# Altium schematic sheet boost-converter.SchDoc
size A4; DrawnBy: Lorna Lan, Jaden Reimer; DocumentNumber: 3; Revision: v4.3; SheetNumber: 3; SheetTotal: 20
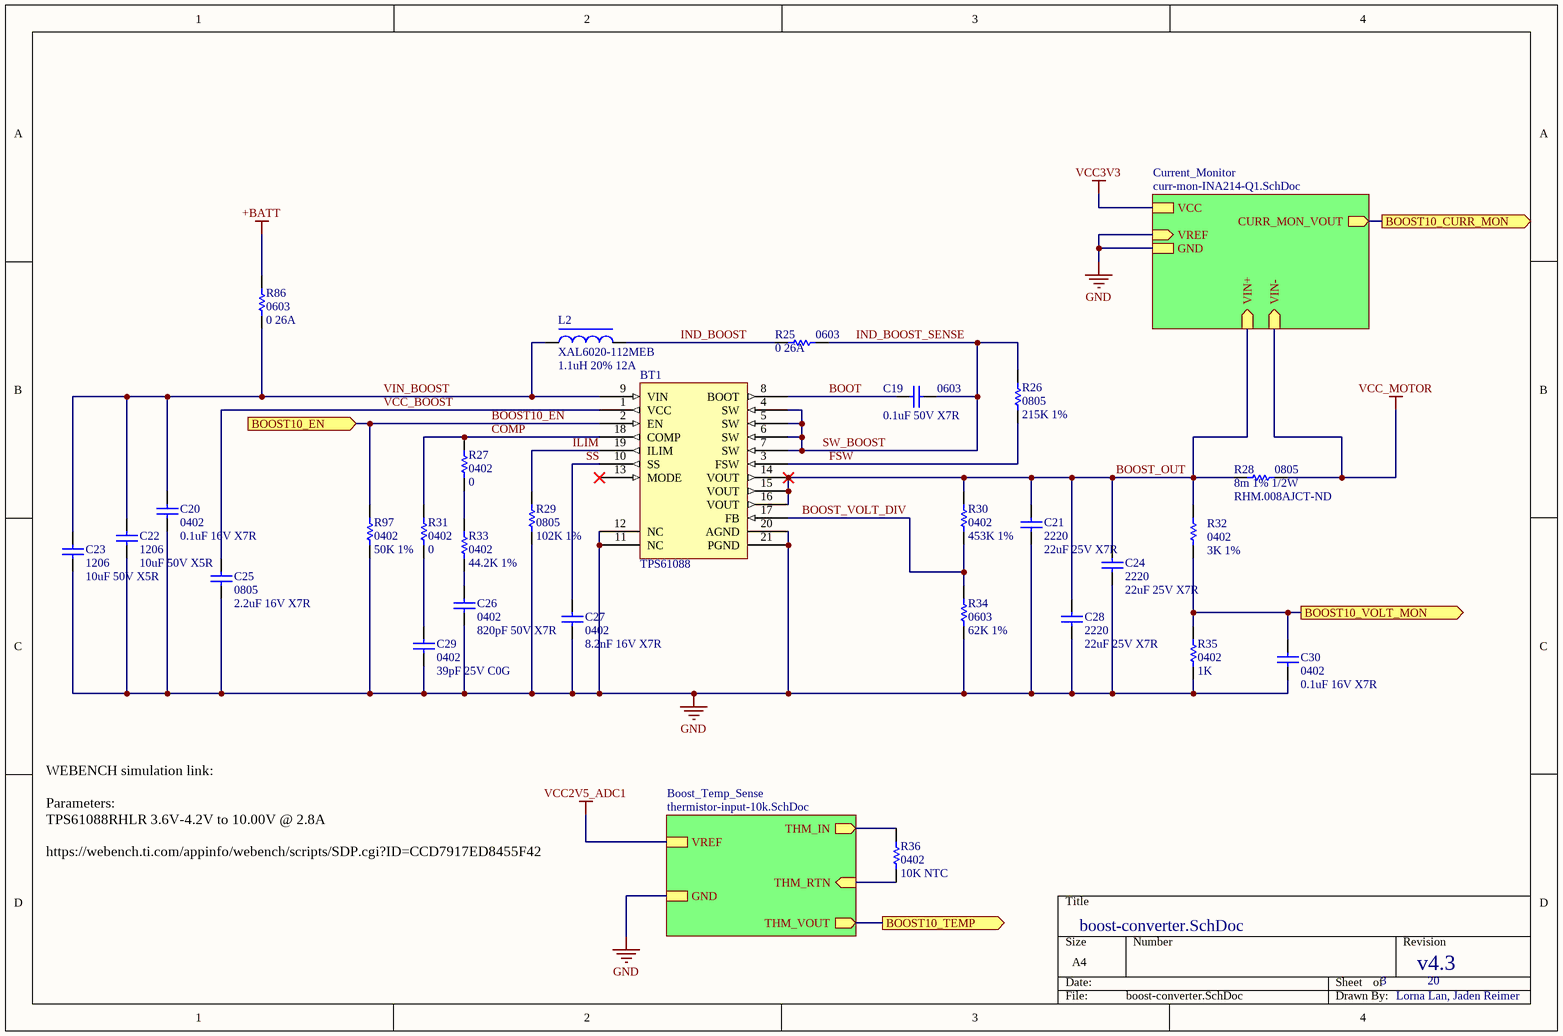
[diagram p0: boost-converter.SchDoc]

## Parts
BT1  TPS61088  [QFN50P450X350X100-21N]
C19  0603  value 0.1uF 50V X7R  [CAP0603R]
C20  0402  value 0.1uF 16V X7R  [CAP0402R]
C21  2220  value 22uF 25V X7R  [CAP2220]
C22  1206  value 10uF 50V X5R  [CAP1206R]
C23  1206  value 10uF 50V X5R  [CAP1206R]
C24  2220  value 22uF 25V X7R  [CAP2220]
C25  0805  value 2.2uF 16V X7R  [CAP0805R]
C26  0402  value 820pF 50V X7R  [CAP0402R]
C27  0402  value 8.2nF 16V X7R  [CAP0402R]
C28  2220  value 22uF 25V X7R  [CAP2220]
C29  0402  value 39pF 25V C0G  [CAP0402R]
C30  0402  value 0.1uF 16V X7R  [CAP0402R]
L2  XAL6020-112MEB  value 1.1uH 20% 12A  [XAL6020-112MEB]
R25  0603  value 0 26A  [RES0603R]
R26  0805  value 215K 1%  [RES0805R]
R27  0402  value 0  [RES0402R]
R28  0805  value 8m 1% 1/2W  Supplier Part Number 1: RHM.008AJCT-ND  [RES0805R]
R29  0805  value 102K 1%  [RES0805R]
R30  0402  value 453K 1%  [RES0402R]
R31  0402  value 0  [RES0402R]
R32  0402  value 3K 1%  [RES0402R]
R33  0402  value 44.2K 1%  [RES0402R]
R34  0603  value 62K 1%  [RES0603R]
R35  0402  value 1K  [RES0402R]
R36  0402  value 10K NTC  [RES0402R]
R86  0603  value 0 26A  [RES0603R]
R97  0402  value 50K 1%  [RES0402R]

## Sub-sheets
Boost_Temp_Sense = thermistor-input-10k.SchDoc: GND, THM_VOUT (out), VREF, THM_IN (out), THM_RTN (in)
Current_Monitor = curr-mon-INA214-Q1.SchDoc: VCC, VREF (in), VIN+ (in), GND, VIN- (in), CURR_MON_VOUT (out)

## Ports
BOOST10_CURR_MON (out), BOOST10_EN (in), BOOST10_TEMP (out), BOOST10_VOLT_MON (out)

## Nets
+BATT: R86.2
GND: BT1.11(NC) BT1.12(NC) BT1.20(AGND) BT1.21(PGND) C20.1 C21.1 C22.1 C23.1 C24.1 C25.1 C26.1 C27.1 C28.1 C29.1 C30.1 R29.1 R34.1 R35.1 R97.1 ; sheet Current_Monitor/VREF, sheet Current_Monitor/GND, sheet Boost_Temp_Sense/GND
VCC2V5_ADC1: sheet Boost_Temp_Sense/VREF
VCC3V3: sheet Current_Monitor/VCC
VCC_MOTOR: R28.2 ; sheet Current_Monitor/VIN-
BOOST10_CURR_MON: port BOOST10_CURR_MON, sheet Current_Monitor/CURR_MON_VOUT
BOOST10_EN: BT1.2(EN) R97.2 ; port BOOST10_EN
BOOST10_TEMP: port BOOST10_TEMP, sheet Boost_Temp_Sense/THM_VOUT
BOOST10_VOLT_MON: C30.2 R32.1 R35.2 ; port BOOST10_VOLT_MON
BOOST_OUT: BT1.14(VOUT) BT1.15(VOUT) BT1.16(VOUT) C21.2 C24.2 C28.2 R28.1 R30.2 R32.2 ; sheet Current_Monitor/VIN+
BOOST_VOLT_DIV: BT1.17(FB) R30.1 R34.2
BOOT: BT1.8(BOOT) C19.1
COMP: BT1.18(COMP) R27.2 R31.2
FSW: BT1.3(FSW) R26.1
ILIM: BT1.19(ILIM) R29.2
IND_BOOST: L2.2 R25.1
IND_BOOST_SENSE: BT1.4(SW) BT1.5(SW) BT1.6(SW) BT1.7(SW) C19.2 R25.2 R26.2  [also labelled SW_BOOST]
SS: BT1.10(SS) C27.2
VCC_BOOST: BT1.1(VCC) C25.2
VIN_BOOST: BT1.9(VIN) C20.2 C22.2 C23.2 L2.1 R86.1
NetC26_2: C26.2 R33.1
NetC29_2: C29.2 R31.1
NetR27_1: R27.1 R33.2
NetR36_1: R36.1 ; sheet Boost_Temp_Sense/THM_RTN
NetR36_2: R36.2 ; sheet Boost_Temp_Sense/THM_IN

Not connected (* = marked no-connect by the designer): BT1 13(MODE)*

## Notes on the sheet
- WEBENCH simulation link:
  Parameters:
  TPS61088RHLR 3.6V-4.2V to 10.00V @ 2.8A
  https://webench.ti.com/appinfo/webench/scripts/SDP.cgi?ID=CCD7917ED8455F42

## Library data of the parts
BT1 = TPS61088: Boost converter; Supplier 1: Digi-Key; Supplier Part Number 1: 296-42129-1-ND
C19 = CAP0603: 0603 capacitor; Supplier 1: Digi-Key; Supplier Part Number 1: 445-5666-1-ND
C20 C26 C27 C29 C30 = CAP0402: 0402 capacitor
  C26: Supplier 1: Digi-Key; Supplier Part Number 1: 490-3250-1-ND
  C27: Supplier 1: Digi-Key; Supplier Part Number 1: 490-6338-1-ND
  C29: Supplier 1: Digi-Key; Supplier Part Number 1: 490-6178-1-ND
C21 C24 C28 = CAP2220: Ceramic Capacitor 2220 (5750 Metric); Supplier 1: Digi-Key; Supplier Part Number 1: 445-7934-1-ND
C22 C23 = CAP1206: 1206 capacitor; Supplier 1: Digi-Key; Supplier Part Number 1: 445-5998-1-ND
C25 = CAP0805: 0805 capacitor; Supplier 1: Digi-Key; Supplier Part Number 1: 490-3906-1-ND
L2 = XAL6020-112MEB: Fixed Inductors 1.1uH 20% 12A, 13.1mOhms AEC-Q200; ComponentLink1Description: Datasheet; ComponentLink1URL: https://www.mouser.ca/datasheet/2/597/xal6020-774588.pdf; Supplier 1: Mouser; Supplier Part Number 1: 994-XAL6020-112MEB
R25 R34 R86 = RES0603: 0603 resistor; Supplier 1: Digi-Key
  R25 R86: Supplier Part Number 1: 2019-TLRZ1JTTDCT-ND
  R34: Supplier Part Number 1: 311-62.0KHRCT-ND
R26 R28 R29 = RES0805: 0805 resistor; Supplier 1: Digi-Key
  R26: Supplier Part Number 1: P215KCCT-ND
  R29: Supplier Part Number 1: 541-102KCCT-ND
R27 R31 = RES0402: 0402 resistor; Manufacturer: Panasonic; Manufacturer Part Number: ERJ-2GE0R00X; Resistance: 0mR; Power Rating: 100mW; Voltage Rating: 50V; Tolerance: 5%; Temperature Coefficient: 600ppm/°C; Supplier 1: Digi-Key; Supplier Part Number 1: P0.0JCT-ND; Stock 1: 47740000; Pricing 1: 1=0.1, 10=0.03, 25=0.0216, 50=0.0164, 100=0.0121, 250=0.00924, 500=0.0074, 1000=0.00545, 5000=0.00391 (USD); Mount: Surface Mount; Case/Package: 0402; Case Code (Metric): 1005; Case Code (Imperial): 0402; Contact Plating: Tin; Min Operating Temperature: -55°C; Max Operating Temperature: 155°C; Packaging: Tape and Reel; Package Quantity: 1; Composition: Thick Film; Number of Terminations: 2; Termination: SMD/SMT; Military Standard: Not; Max Power Dissipation: 100mW; Voltage Rating (DC): 50V; Features: Automotive AEC-Q200; Length: 1mm; Height: 0.35mm; Width: 0.02inch; Depth: 0.5mm; Radiation Hardening: No; REACH SVHC: No SVHC; Lead Free: Lead Free; ComponentLink1URL: http://industrial.panasonic.com/www-data/pdf/AOA0000/AOA0000CE1.pdf?src-supplier=Avnet; ComponentLink1Description: http://industrial.panasonic.com/www-data/pdf/AOA0000/AOA0000CE1.pdf?src-supplier=Avnet; ComponentLink2URL: http://www.alliedelec.com/m/d/51cd0790071e1666bdb9d00c57fcf960.pdf?src-supplier=Allied+Electronics; ComponentLink2Description: http://www.alliedelec.com/m/d/51cd0790071e1666bdb9d00c57fcf960.pdf?src-supplier=Allied+Electronics; ComponentLink3URL: http://industrial.panasonic.com/www-data/pdf/AOA0000/AOA0000CE1.pdf?src-supplier=Avnet+Europe; ComponentLink3Description: http://industrial.panasonic.com/www-data/pdf/AOA0000/AOA0000CE1.pdf?src-supplier=Avnet+Europe; ComponentLink4URL: http://www.farnell.com/datasheets/2059623.pdf?src-supplier=Farnell; ComponentLink4Description: http://www.farnell.com/datasheets/2059623.pdf?src-supplier=Farnell; ComponentLink5URL: http://www.farnell.com/datasheets/2059623.pdf?src-supplier=Element14; ComponentLink5Description: http://www.farnell.com/datasheets/2059623.pdf?src-supplier=Element14; ComponentLink6URL: http://www.farnell.com/datasheets/1678796.pdf?src-supplier=Element14; ComponentLink6Description: http://www.farnell.com/datasheets/1678796.pdf?src-supplier=Element14
R30 R32 R33 R35 R36 R97 = RES0402: 0402 resistor
  R30: Supplier 1: Digi-Key; Supplier Part Number 1: 541-453KLCT-ND
  R32: Supplier 1: Digi-Key; Supplier Part Number 1: RMCF0402FT3K00CT-ND
  R35: Supplier 1: Digi-Key; Supplier Part Number 1: YAG1234CT-ND